# Altium schematic sheet 光敏电阻原理图.SchDoc
size A3
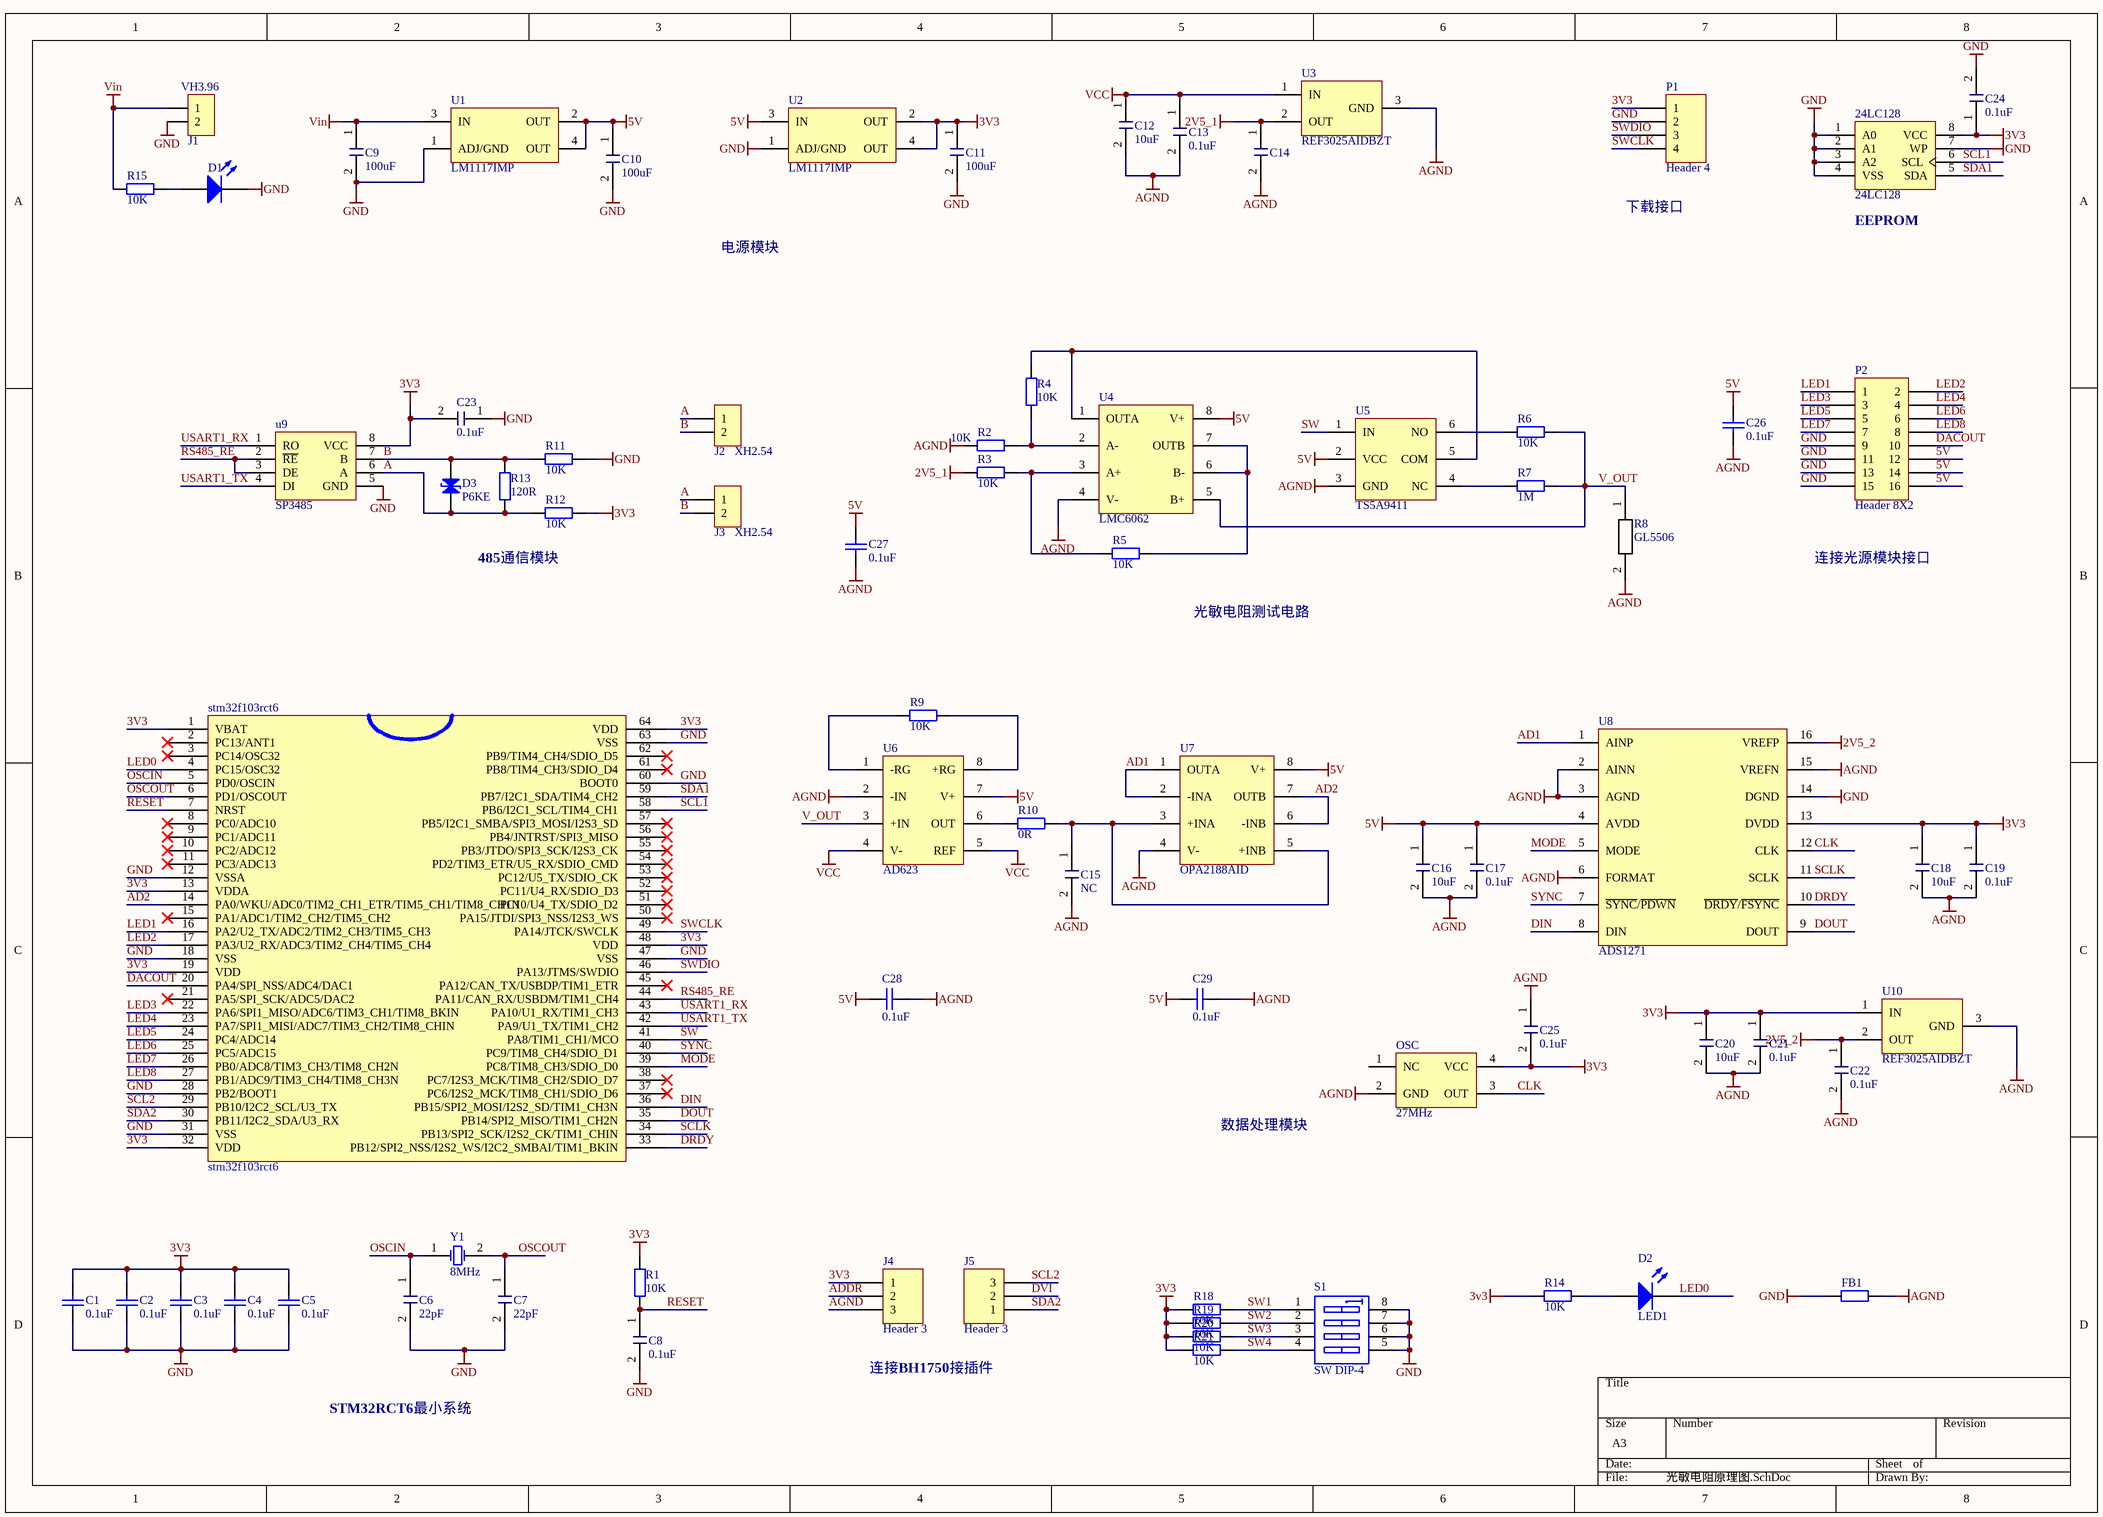
[diagram p0: 光敏电阻原理图.SchDoc]

## Parts
24LC128  24LC128  [24LC128]
C1  value 0.1uF  [RAD-0.3]  (hidden comment: Cap)
C2  value 0.1uF  [RAD-0.3]  (hidden comment: Cap)
C3  value 0.1uF  [RAD-0.3]  (hidden comment: Cap)
C4  value 0.1uF  [RAD-0.3]  (hidden comment: Cap)
C5  value 0.1uF  [RAD-0.3]  (hidden comment: Cap)
C6  无极性贴片电容  [C 0603_M]  (value not drawn)
C7  无极性贴片电容  [C 0603_M]  (value not drawn)
C8  无极性贴片电容  [C 0603_M]  (value not drawn)
C9  无极性贴片电容  [C 0603_M]  (value not drawn)
C10  无极性贴片电容  [C 0603_M]  (value not drawn)
C11  无极性贴片电容  [C 0603_M]  (value not drawn)
C12  10uF  [C 0603_M]
C13  0.1uF  [C 0603_M]
C14  无极性贴片电容  [C 0603_M]  (value not drawn)
C15  无极性贴片电容  [C 0603_M]  (value not drawn)
C16  无极性贴片电容  [C 0603_M]  (value not drawn)
C17  无极性贴片电容  [C 0603_M]  (value not drawn)
C18  无极性贴片电容  [C 0603_M]  (value not drawn)
C19  无极性贴片电容  [C 0603_M]  (value not drawn)
C20  无极性贴片电容  [C 0603_M]  (value not drawn)
C21  无极性贴片电容  [C 0603_M]  (value not drawn)
C22  无极性贴片电容  [C 0603_M]  (value not drawn)
C23  无极性贴片电容  [C 0603_M]  (value not drawn)
C24  无极性贴片电容  [C 0603_M]  (value not drawn)
C25  无极性贴片电容  [C 0603_M]  (value not drawn)
C26  value 0.1uF  [RAD-0.3]  (hidden comment: Cap)
C27  value 0.1uF  [RAD-0.3]  (hidden comment: Cap)
C28  value 0.1uF  [RAD-0.3]  (hidden comment: Cap)
C29  value 0.1uF  [RAD-0.3]  (hidden comment: Cap)
D1  LED1  [LED-1]  (value not drawn)
D2  LED1  [LED-1]
D3  P6KE  [TVS]
FB1  Res2  [AXIAL-0.4]  (value not drawn)
J1  VH3.96  [VH3.96-LI-2P]
J2  XH2.54  [XH2.54-WI-2P]
J3  XH2.54  [XH2.54-WI-2P]
J4  Header 3  [HDR1X3]
J5  Header 3  [HDR1X3]
OSC  27MHz  [OSC-SMD_4P-L3.2-W2.5-BL-CXC3X260000GHVRT3R]
P1  Header 4  [HDR1X4]
P2  Header 8X2  [HDR2X8]
R1  value 10K  [R 0603_M]  (hidden comment: Res2)
R2  value 10K  [R 0603_M]  (hidden comment: Res2)
R3  value 10K  [R 0603_M]  (hidden comment: Res2)
R4  value 10K  [R 0603_M]  (hidden comment: Res2)
R5  value 10K  [R 0603_M]  (hidden comment: Res2)
R6  value 10K  [R 0603_M]  (hidden comment: Res2)
R7  value 1M  [R 0603_M]  (hidden comment: Res2)
R8  GL5506  [GL5506]
R9  value 10K  [R 0603_M]  (hidden comment: Res2)
R10  value 0R  [R 0603_L]  (hidden comment: Res2)
R11  value 10K  [R 0603_M]  (hidden comment: Res2)
R12  value 10K  [R 0603_M]  (hidden comment: Res2)
R13  value 120R  [R 0603_M]  (hidden comment: Res2)
R14  value 10K  [R 0603_M]  (hidden comment: Res2)
R15  value 10K  [R 0603_M]  (hidden comment: Res2)
R18  value 10K  [R 0603_M]  (hidden comment: Res2)
R19  value 10K  [R 0603_M]  (hidden comment: Res2)
R20  value 10K  [R 0603_M]  (hidden comment: Res2)
R21  value 10K  [R 0603_M]  (hidden comment: Res2)
S1  SW DIP-4  [SO8]
stm32f103rct6  stm32f103rct6  [LQFP-64]  (value not drawn)
U1  LM1117IMP  [LM1117]
U2  LM1117IMP  [LM1117]
U3  REF3025AIDBZT  [SOT23-3]
U4  LMC6062  [LMC6062]
U5  TS5A9411  [TS5A9411]
U6  AD623  [AD623]
U7  OPA2188AID  [OPA2188]
U8  ADS1271  [ADS1271]
u9  SP3485  [SP3485-SOIC]
U10  REF3025AIDBZT  [SOT23-3]
Y1  8MHz  [R38]

## Nets
2V5_1: C14.1 R3.1 U3.2(OUT)
2V5_2: C22.1 U8.16(VREFP) U10.2(OUT)
3V3: 24LC128.8(VCC) C1.2 C2.2 C3.2 C4.2 C5.2 C11.1 C18.1 C19.1 C20.1 C21.1 C23.2 C24.1 C25.2 J4.1 OSC.4(VCC) P1.1 R1.2 R12.1 R14.1 R18.2 R19.2 R20.2 R21.2 stm32f103rct6.1(VBAT) stm32f103rct6.13(VDDA) stm32f103rct6.19(VDD) stm32f103rct6.32(VDD) stm32f103rct6.48(VDD) stm32f103rct6.64(VDD) U2.2(OUT) U2.4(OUT) U8.13(DVDD) u9.8(VCC) U10.1(IN)
5V: C10.1 C16.1 C17.1 C26.2 C27.2 C28.2 C29.2 P2.12 P2.14 P2.16 U1.2(OUT) U1.4(OUT) U2.3(IN) U4.8(V+) U5.2(VCC) U6.7(V+) U7.8(V+) U8.4(AVDD)
AGND: C12.2 C13.2 C14.2 C15.2 C16.2 C17.2 C18.2 C19.2 C20.2 C21.2 C22.2 C25.1 C26.1 C27.1 C28.1 C29.1 FB1.2 J4.3 OSC.2(GND) R2.1 R8.2 U3.3(GND) U4.4(V-) U5.3(GND) U6.2(-IN) U7.4(V-) U8.2(AINN) U8.3(AGND) U8.6(FORMAT) U8.15(VREFN) U10.3(GND)
GND: 24LC128.1(A0) 24LC128.2(A1) 24LC128.3(A2) 24LC128.4(VSS) 24LC128.7(WP) C1.1 C2.1 C3.1 C4.1 C5.1 C6.2 C7.2 C8.2 C9.2 C10.2 C11.2 C23.1 C24.2 D1.2(K) FB1.1 J1.2 P1.2 P2.9 P2.11 P2.13 P2.15 R11.1 S1.5(B4) S1.6(B3) S1.7(B2) S1.8(B1) stm32f103rct6.12(VSSA) stm32f103rct6.18(VSS) stm32f103rct6.28(PB2/BOOT1) stm32f103rct6.31(VSS) stm32f103rct6.47(VSS) stm32f103rct6.60(BOOT0) stm32f103rct6.63(VSS) U1.1(ADJ/GND) U2.1(ADJ/GND) U8.14(DGND) u9.5(GND)
VCC: C12.1 C13.1 U3.1(IN) U6.4(V-) U6.5(REF)
Vin: C9.1 J1.1 R15.1 U1.3(IN)
A: D3.2(K) J2.1 J3.1 R12.2 R13.2 u9.6(A)
AD1: U7.1(OUTA) U7.2(-INA) U8.1(AINP)
AD2: stm32f103rct6.14(PA0/WKU/ADC0/TIM2_CH1_ETR/TIM5_CH1/TIM8_CH1N) U7.6(-INB) U7.7(OUTB)
ADDR: J4.2
B: D3.1(A) J2.2 J3.2 R11.2 R13.1 u9.7(B)
CLK: OSC.3(OUT) U8.12(CLK)
DACOUT: P2.10 stm32f103rct6.20(PA4/SPI_NSS/ADC4/DAC1)
DIN: stm32f103rct6.36(PB15/SPI2_MOSI/I2S2_SD/TIM1_CH3N) U8.8(DIN)
DOUT: stm32f103rct6.35(PB14/SPI2_MISO/TIM1_CH2N) U8.9(DOUT)
DRDY: stm32f103rct6.33(PB12/SPI2_NSS/I2S2_WS/I2C2_SMBAI/TIM1_BKIN) U8.10(~{DRDY}/~{FSYNC})
DVI: J5.2
LED0: D2.2(K) stm32f103rct6.4(PC15/OSC32)
LED1: P2.1 stm32f103rct6.16(PA2/U2_TX/ADC2/TIM2_CH3/TIM5_CH3)
LED2: P2.2 stm32f103rct6.17(PA3/U2_RX/ADC3/TIM2_CH4/TIM5_CH4)
LED3: P2.3 stm32f103rct6.22(PA6/SPI1_MISO/ADC6/TIM3_CH1/TIM8_BKIN)
LED4: P2.4 stm32f103rct6.23(PA7/SPI1_MISI/ADC7/TIM3_CH2/TIM8_CHIN)
LED5: P2.5 stm32f103rct6.24(PC4/ADC14)
LED6: P2.6 stm32f103rct6.25(PC5/ADC15)
LED7: P2.7 stm32f103rct6.26(PB0/ADC8/TIM3_CH3/TIM8_CH2N)
LED8: P2.8 stm32f103rct6.27(PB1/ADC9/TIM3_CH4/TIM8_CH3N)
MODE: stm32f103rct6.39(PC8/TIM8_CH3/SDIO_D0) U8.5(MODE)
OSCIN: C6.1 stm32f103rct6.5(PD0/OSCIN) Y1.1(OSC1)
OSCOUT: C7.1 stm32f103rct6.6(PD1/OSCOUT) Y1.2(OSC2)
RESET: C8.1 R1.1 stm32f103rct6.7(NRST)
RS485_RE: stm32f103rct6.44(PA11/CAN_RX/USBDM/TIM1_CH4) u9.2(~{RE}) u9.3(DE)
SCL1: 24LC128.6(SCL) stm32f103rct6.58(PB6/I2C1_SCL/TIM4_CH1)
SCL2: J5.3 stm32f103rct6.29(PB10/I2C2_SCL/U3_TX)
SCLK: stm32f103rct6.34(PB13/SPI2_SCK/I2S2_CK/TIM1_CHIN) U8.11(SCLK)
SDA1: 24LC128.5(SDA) stm32f103rct6.59(PB7/I2C1_SDA/TIM4_CH2)
SDA2: J5.1 stm32f103rct6.30(PB11/I2C2_SDA/U3_RX)
SW: stm32f103rct6.41(PA8/TIM1_CH1/MCO) U5.1(IN)
SW1: R18.1 S1.1(A1)
SW2: R19.1 S1.2(A2)
SW3: R20.1 S1.3(A3)
SW4: R21.1 S1.4(A4)
SWCLK: P1.4 stm32f103rct6.49(PA14/JTCK/SWCLK)
SWDIO: P1.3 stm32f103rct6.46(PA13/JTMS/SWDIO)
SYNC: stm32f103rct6.40(PC9/TIM8_CH4/SDIO_D1) U8.7(~{SYNC}/~{PDWN})
USART1_RX: stm32f103rct6.43(PA10/U1_RX/TIM1_CH3) u9.1(RO)
USART1_TX: stm32f103rct6.42(PA9/U1_TX/TIM1_CH2) u9.4(DI)
V_OUT: R6.1 R7.1 R8.1 U4.5(B+) U6.3(+IN)
NetC15_1: C15.1 R10.2 U7.3(+INA) U7.5(+INB)
NetD1_1: D1.1(A) R15.2
NetD2_1: D2.1(A) R14.2
NetR2_2: R2.2 R4.1 U4.2(A-)
NetR3_2: R3.2 R5.2 U4.3(A+)
NetR4_2: R4.2 U4.1(OUTA) U5.5(COM)
NetR5_1: R5.1 U4.6(B-) U4.7(OUTB)
NetR6_2: R6.2 U5.6(NO)
NetR7_2: R7.2 U5.4(NC)
NetR9_1: R9.1 U6.1(-RG)
NetR9_2: R9.2 U6.8(+RG)
NetR10_1: R10.1 U6.6(OUT)

Not connected (* = marked no-connect by the designer): OSC 1(NC); stm32f103rct6 2(PC13/ANT1)* 3(PC14/OSC32)* 8(PC0/ADC10)* 9(PC1/ADC11)* 10(PC2/ADC12)* 11(PC3/ADC13)* 15(PA1/ADC1/TIM2_CH2/TIM5_CH2)* 21(PA5/SPI_SCK/ADC5/DAC2)* 37(PC6/I2S2_MCK/TIM8_CH1/SDIO_D6)* 38(PC7/I2S3_MCK/TIM8_CH2/SDIO_D7)* 45(PA12/CAN_TX/USBDP/TIM1_ETR)* 50(PA15/JTDI/SPI3_NSS/I2S3_WS)* 51(PC10/U4_TX/SDIO_D2)* 52(PC11/U4_RX/SDIO_D3)* 53(PC12/U5_TX/SDIO_CK)* 54(PD2/TIM3_ETR/U5_RX/SDIO_CMD)* 55(PB3/JTDO/SPI3_SCK/I2S3_CK)* 56(PB4/JNTRST/SPI3_MISO)* 57(PB5/I2C1_SMBA/SPI3_MOSI/I2S3_SD)* 61(PB8/TIM4_CH3/SDIO_D4)* 62(PB9/TIM4_CH4/SDIO_D5)*

## Notes on the sheet
- 电源模块
- (near P1) 下载接口
- (near 24LC128) EEPROM
- 485通信模块
- 连接光源模块接口
- 光敏电阻测试电路
- 数据处理模块
- 连接BH1750接插件
- STM32RCT6最小系统
- (in symbol 贴片电容) 100uF; 0.1uF; 22pF; NC; 10uF

## Library data of the parts
C1-C5 C26-C29 = Cap: Capacitor; Published: 8-Jun-2000; LatestRevisionDate: 17-Jul-2002; LatestRevisionNote: Re-released for DXP Platform.; PackageReference: RAD-0.3; Publisher: Altium Limited
C6-C25 = 贴片电容
D1 D2 = LED1: Typical RED GaAs LED; Published: 8-Jun-2000; LatestRevisionDate: 08-Jul-2005; LatestRevisionNote: Mech Layer 1 removed.; PackageReference: LED-1; Publisher: Altium Limited
D3 = DR: 瞬态电压抑制二极管; 版权归属: 源创客; BOM名称: 瞬态电压抑制二极管; 学习资源: www.ooocke.com
FB1 = Res2: Resistor; Value: FB; Published: 8-Jun-2000; LatestRevisionDate: 17-Jul-2002; LatestRevisionNote: Re-released for DXP Platform.; PackageReference: AXIAL-0.4; Publisher: Altium Limited
J1-J3 = Header 2: 2P接插件; 版权归属: 源创客; BOM名称: 2P接插件; 学习资源: www.ooocke.com
J4 J5 = Header 3: Header, 3-Pin; LatestRevisionDate: 17-Jul-2002; LatestRevisionNote: Re-released for DXP Platform.; Publisher: Altium Limited
OSC = OSC
P1 = Header 4: Header, 4-Pin; LatestRevisionDate: 17-Jul-2002; LatestRevisionNote: Re-released for DXP Platform.; Publisher: Altium Limited
P2 = Header 8X2: Header, 8-Pin, Dual row; LatestRevisionDate: 17-Jul-2002; LatestRevisionNote: Re-released for DXP Platform.; Publisher: Altium Limited
R1-R7 R9-R15 R18-R21 = Res2: Resistor; Published: 8-Jun-2000; LatestRevisionDate: 17-Jul-2002; LatestRevisionNote: Re-released for DXP Platform.; PackageReference: AXIAL-0.4; Publisher: Altium Limited
S1 = SW DIP-4: DIP Switch, 4 Position, SPST; Published: 24-Mar-1999; LatestRevisionDate: 17-Jul-2002; LatestRevisionNote: Re-released for DXP Platform.; PackageReference: SO8; Publisher: Altium Limited; Code_JEDEC: MS-012-AA; Code_IPC: SO8
Y1 = XTAL: Crystal Oscillator; Published: 8-Jun-2000; LatestRevisionDate: 17-Jul-2002; LatestRevisionNote: Re-released for DXP Platform.; PackageReference: R38; Publisher: Altium Limited